# Altium schematic sheet UVC_Controller.SchDoc
size A4
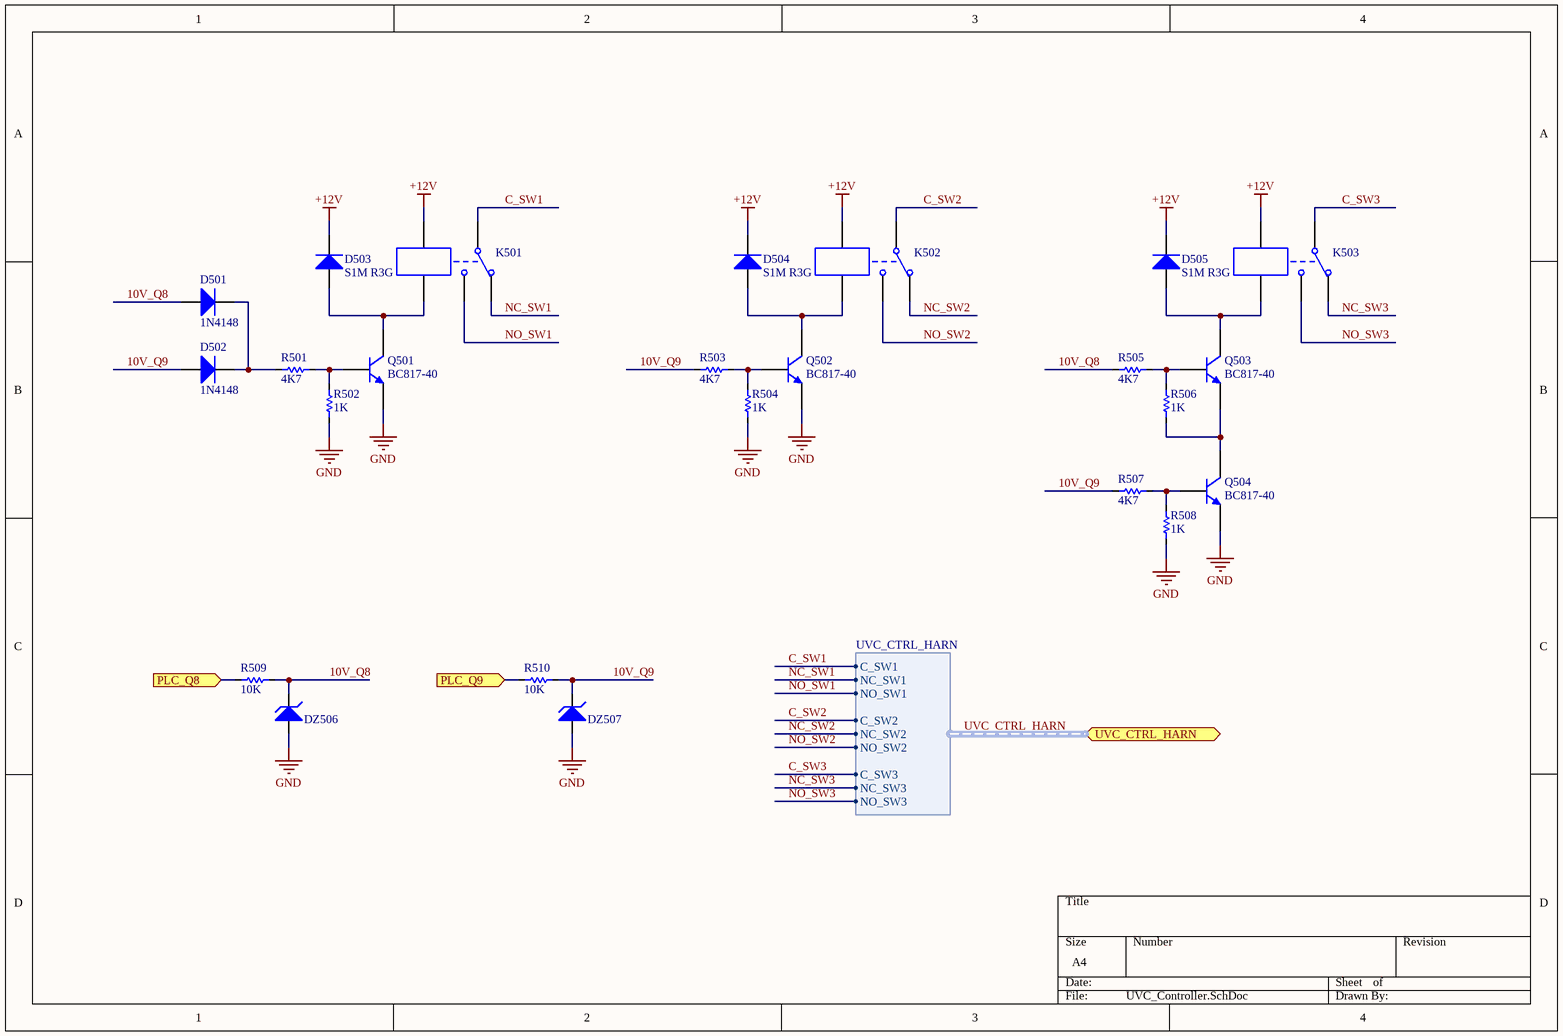
[diagram p0: UVC_Controller.SchDoc]

## Parts
D501  VALOR: 1N4148  [SOD-80]  (hidden comment: Diodo Rectificador SMD)
D502  VALOR: 1N4148  [SOD-80]  (hidden comment: Diodo Rectificador SMD)
D503  VALOR: S1M R3G  [DO-214]  (hidden comment: Diodo Rectificador SMD)
D504  VALOR: S1M R3G  [DO-214]  (hidden comment: Diodo Rectificador SMD)
D505  VALOR: S1M R3G  [DO-214]  (hidden comment: Diodo Rectificador SMD)
DZ506  Diodo Zenner SMD  [SOD-80]  (value not drawn)
DZ507  Diodo Zenner SMD  [SOD-80]  (value not drawn)
K501  Relay-SPDT  [JS1-5V-F]  (value not drawn)
K502  Relay-SPDT  [JS1-5V-F]  (value not drawn)
K503  Relay-SPDT  [JS1-5V-F]  (value not drawn)
Q501  BC817-40  [SOT23_M]
Q502  BC817-40  [SOT23_M]
Q503  BC817-40  [SOT23_M]
Q504  BC817-40  [SOT23_M]
R501  VALOR: 4K7  [R0603]  (hidden comment: Res SMD)
R502  VALOR: 1K  [R0603]  (hidden comment: Res SMD)
R503  VALOR: 4K7  [R0603]  (hidden comment: Res SMD)
R504  VALOR: 1K  [R0603]  (hidden comment: Res SMD)
R505  VALOR: 4K7  [R0603]  (hidden comment: Res SMD)
R506  VALOR: 1K  [R0603]  (hidden comment: Res SMD)
R507  VALOR: 4K7  [R0603]  (hidden comment: Res SMD)
R508  VALOR: 1K  [R0603]  (hidden comment: Res SMD)
R509  VALOR: 10K  [R0603]  (hidden comment: Res SMD)
R510  VALOR: 10K  [R0603]  (hidden comment: Res SMD)

## Ports
PLC_Q8 (in), PLC_Q9 (in), UVC_CTRL_HARN (harness UVC_CTRL_HARN)

## Harnesses
UVC_CTRL_HARN: C_SW1, NC_SW1, NO_SW1, C_SW2, NC_SW2, NO_SW2, C_SW3, NC_SW3, NO_SW3

## Nets
+12V: D503.2(K) D504.2(K) D505.2(K) K501.4 K502.4 K503.4
GND: DZ506.1(A) DZ507.1(A) Q501.2(E) Q502.2(E) Q504.2(E) R502.2 R504.2 R508.2
10V_Q8: D501.1(A) DZ506.2(K) R505.2 R509.2
10V_Q9: D502.1(A) DZ507.2(K) R503.2 R507.2 R510.2
C_SW1: K501.1 ; port UVC_CTRL_HARN.C_SW1
C_SW2: K502.1 ; port UVC_CTRL_HARN.C_SW2
C_SW3: K503.1 ; port UVC_CTRL_HARN.C_SW3
NC_SW1: K501.2 ; port UVC_CTRL_HARN.NC_SW1
NC_SW2: K502.2 ; port UVC_CTRL_HARN.NC_SW2
NC_SW3: K503.2 ; port UVC_CTRL_HARN.NC_SW3
NO_SW1: K501.3 ; port UVC_CTRL_HARN.NO_SW1
NO_SW2: K502.3 ; port UVC_CTRL_HARN.NO_SW2
NO_SW3: K503.3 ; port UVC_CTRL_HARN.NO_SW3
PLC_Q8: R509.1 ; port PLC_Q8
PLC_Q9: R510.1 ; port PLC_Q9
NetD501_2: D501.2(K) D502.2(K) R501.2
NetD503_1: D503.1(A) K501.5 Q501.3(C)
NetD504_1: D504.1(A) K502.5 Q502.3(C)
NetD505_1: D505.1(A) K503.5 Q503.3(C)
NetQ501_1: Q501.1(B) R501.1 R502.1
NetQ502_1: Q502.1(B) R503.1 R504.1
NetQ503_1: Q503.1(B) R505.1 R506.1
NetQ503_2: Q503.2(E) Q504.3(C) R506.2
NetQ504_1: Q504.1(B) R507.1 R508.1

## Buses and harness runs
harness UVC_CTRL_HARN = port UVC_CTRL_HARN

## Library data of the parts
D501-D505 = Diodo Rectificador SMD: Diodo Rectificador; PROVEEDOR: *; CODIGO RUF: *; FABRIANTE: *
  D501 D502: Arrow: FDLL4148; Digikey: FDLL4148TR-ND
  D503-D505: Arrow: S1M R3G; Digikey: S1MR3GDKR-ND
K501-K503 = Relay-SPDT: Single-Pole Dual-Throw Relay; Published: 24-Mar-1999; LatestRevisionDate: 17-Jul-2002; LatestRevisionNote: Re-released for DXP Platform.; PackageReference: MODULE5B; Publisher: Altium Limited; Arrow: JS1-12V-F; Digikey: 255-2080-ND
Q501-Q504 = BC817-40: NPN General-purpose Transistor; Published: 17-Sep-2003; LatestRevisionDate: 12-Dec-2006; LatestRevisionNote: IPC-7351 Footprint Added.; DatasheetVersion: Jun-1999; PackageVersion: May-1999; PackageReference: SOT23; Publisher: Altium Limited; PackageDescription: 3-Pin SOT-23 Package 0.95 mm Pitch, 2.3 mm Lead Span; ComponentLink1Description: Manufacturer Link; ComponentLink1URL: http://www.semiconductors.philips.com/; ComponentLink2Description: Datasheet; ComponentLink2URL: http://www.semiconductors.philips.com/acrobat/datasheets/BC817_BC817W_BC337_5.pdf; Arrow: BC817-25-TP; Digikey: BC817-25-TPMSCT-ND
DZ506 DZ507 = Diodo Zenner SMD: VALOR: *; PROVEEDOR: *; CODIGO RUF: *; FABRICANTE: *; Arrow: TLZ10C-GS08; Digikey: 112-TLZ10C-GS08CT-ND
R501-R510 = Res SMD: CODIGO RUF: *; PROVEEDOR: *; FABRICANTE: *
  R501 R503 R505 R507: Arrow: RC0805FR-074K7L; Digikey: 311-4.70KCRCT-ND
  R502 R504 R506 R508: Arrow: RCA06031K00FKEA; Digikey: YAG2323CT-ND
  R509 R510: Arrow: MCT06030C1002FP500; Digikey: RMCF0603FT10K0CT-ND